# EAGLE design schema_mpb1_1 (EAGLE 9.0.1)

## Sheet 1 of 4: Power Conversion
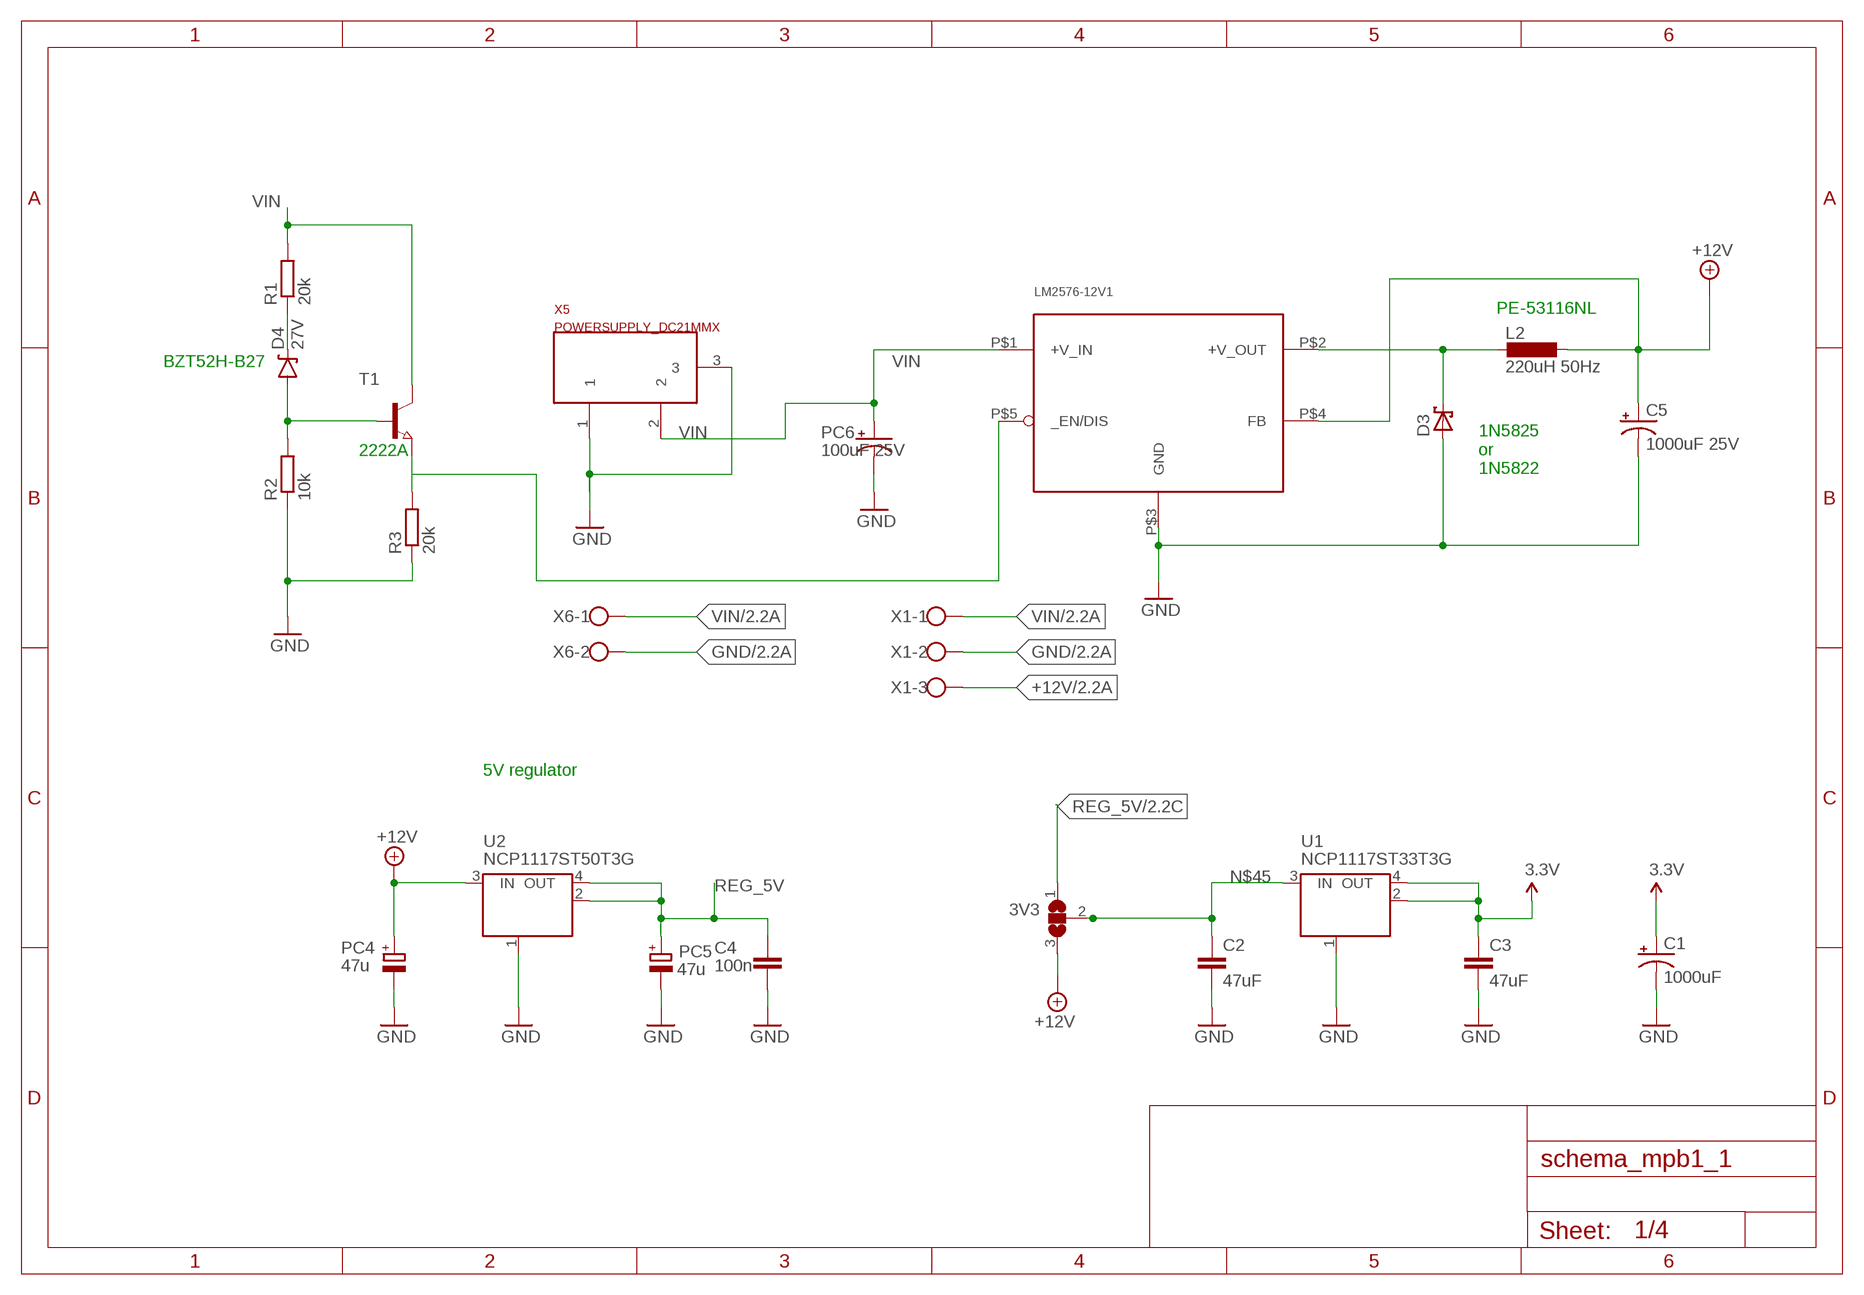
[diagram p0: schematic, sheet 1]

### Parts
3V3  SJ2W  [SJ_2]
C1  1000uF  CPOL-USE5-6  [E5-6]
C2  47uF  C-EUC0603  [C0603]
C3  47uF  C-EUC0603  [C0603]
C4  100n  C-EU0603-RND  [C0603-ROUND]
C5  1000uF 25V  CPOL-USE5-6  [E5-6]
D3  1N5908  [C4111-15]
D4  27V  DIODE-ZENER16V  [SOD-123]
L2  220uH 50Hz  L-KM4.0  [KM-4.0]
LM2576-12V1  LM2576-T05D  [TO220-5_STAGGERED]
PC4  47u  CPOL-EUD  [PANASONIC_D]
PC5  47u  CPOL-EUD  [PANASONIC_D]
PC6  100uF 25V  CPOL-USE5-6  [E5-6]
R1  20k  R-EU_R0603  [R0603]
R2  10k  R-EU_R0603  [R0603]
R3  20k  R-EU_R0603  [R0603]
T1  NPN-TRANSISTOR_SOT23  [SOT23]
U1  NCP1117ST33T3G  MC33269ST-3.3T3  [SOT223]
U2  NCP1117ST50T3G  MC33269ST-3.3T3  [SOT223]
X1  W237-103  [W237-103]
X5  POWERSUPPLY_DC21MMX  [POWERSUPPLY_DC-21MM]
X6  W237-102  [W237-102]

### Nets
3.3V [power]: C1.+ C3.1 U1.2(OUT) U1.4(OUT) ; also sheet 2
+12V: 3V3.3 C5.+ L2.P$2 LM2576-12V1.P$4(FB) PC4.+ U2.3(IN) X1.3 ; also sheet 2
GND [gnd]: C1.- C2.2 C3.2 C4.1 C5.- D3.A LM2576-12V1.P$3(GND) PC4.- PC5.- PC6.- R2.1 R3.1 U1.1(GND/ADJ) U2.1(GND/ADJ) X1.2 X5.1 X5.3 X6.2 ; also sheet 2
N$1: D3.C L2.P$1 LM2576-12V1.P$2(+V_OUT)
N$2: D4.A R2.2 T1.1(B)
N$3: D4.C R1.1
N$4 [gnd]: LM2576-12V1.P$5(_EN/DIS) R3.2 T1.2(E)
N$45: 3V3.2 C2.1 U1.3(IN)
REG_5V: 3V3.1 C4.2 PC5.+ U2.2(OUT) U2.4(OUT) ; also sheet 2
VIN [power]: LM2576-12V1.P$1(+V_IN) PC6.+ R1.2 T1.3(C) X1.1 X5.2 X6.1 ; also sheet 2

### Notes on the sheet
- PE-53116NL
- BZT52H-B27
- 2222A
- 1N5825
  or
  1N5822
- 5V regulator

## Sheet 2 of 4: General Board Outline
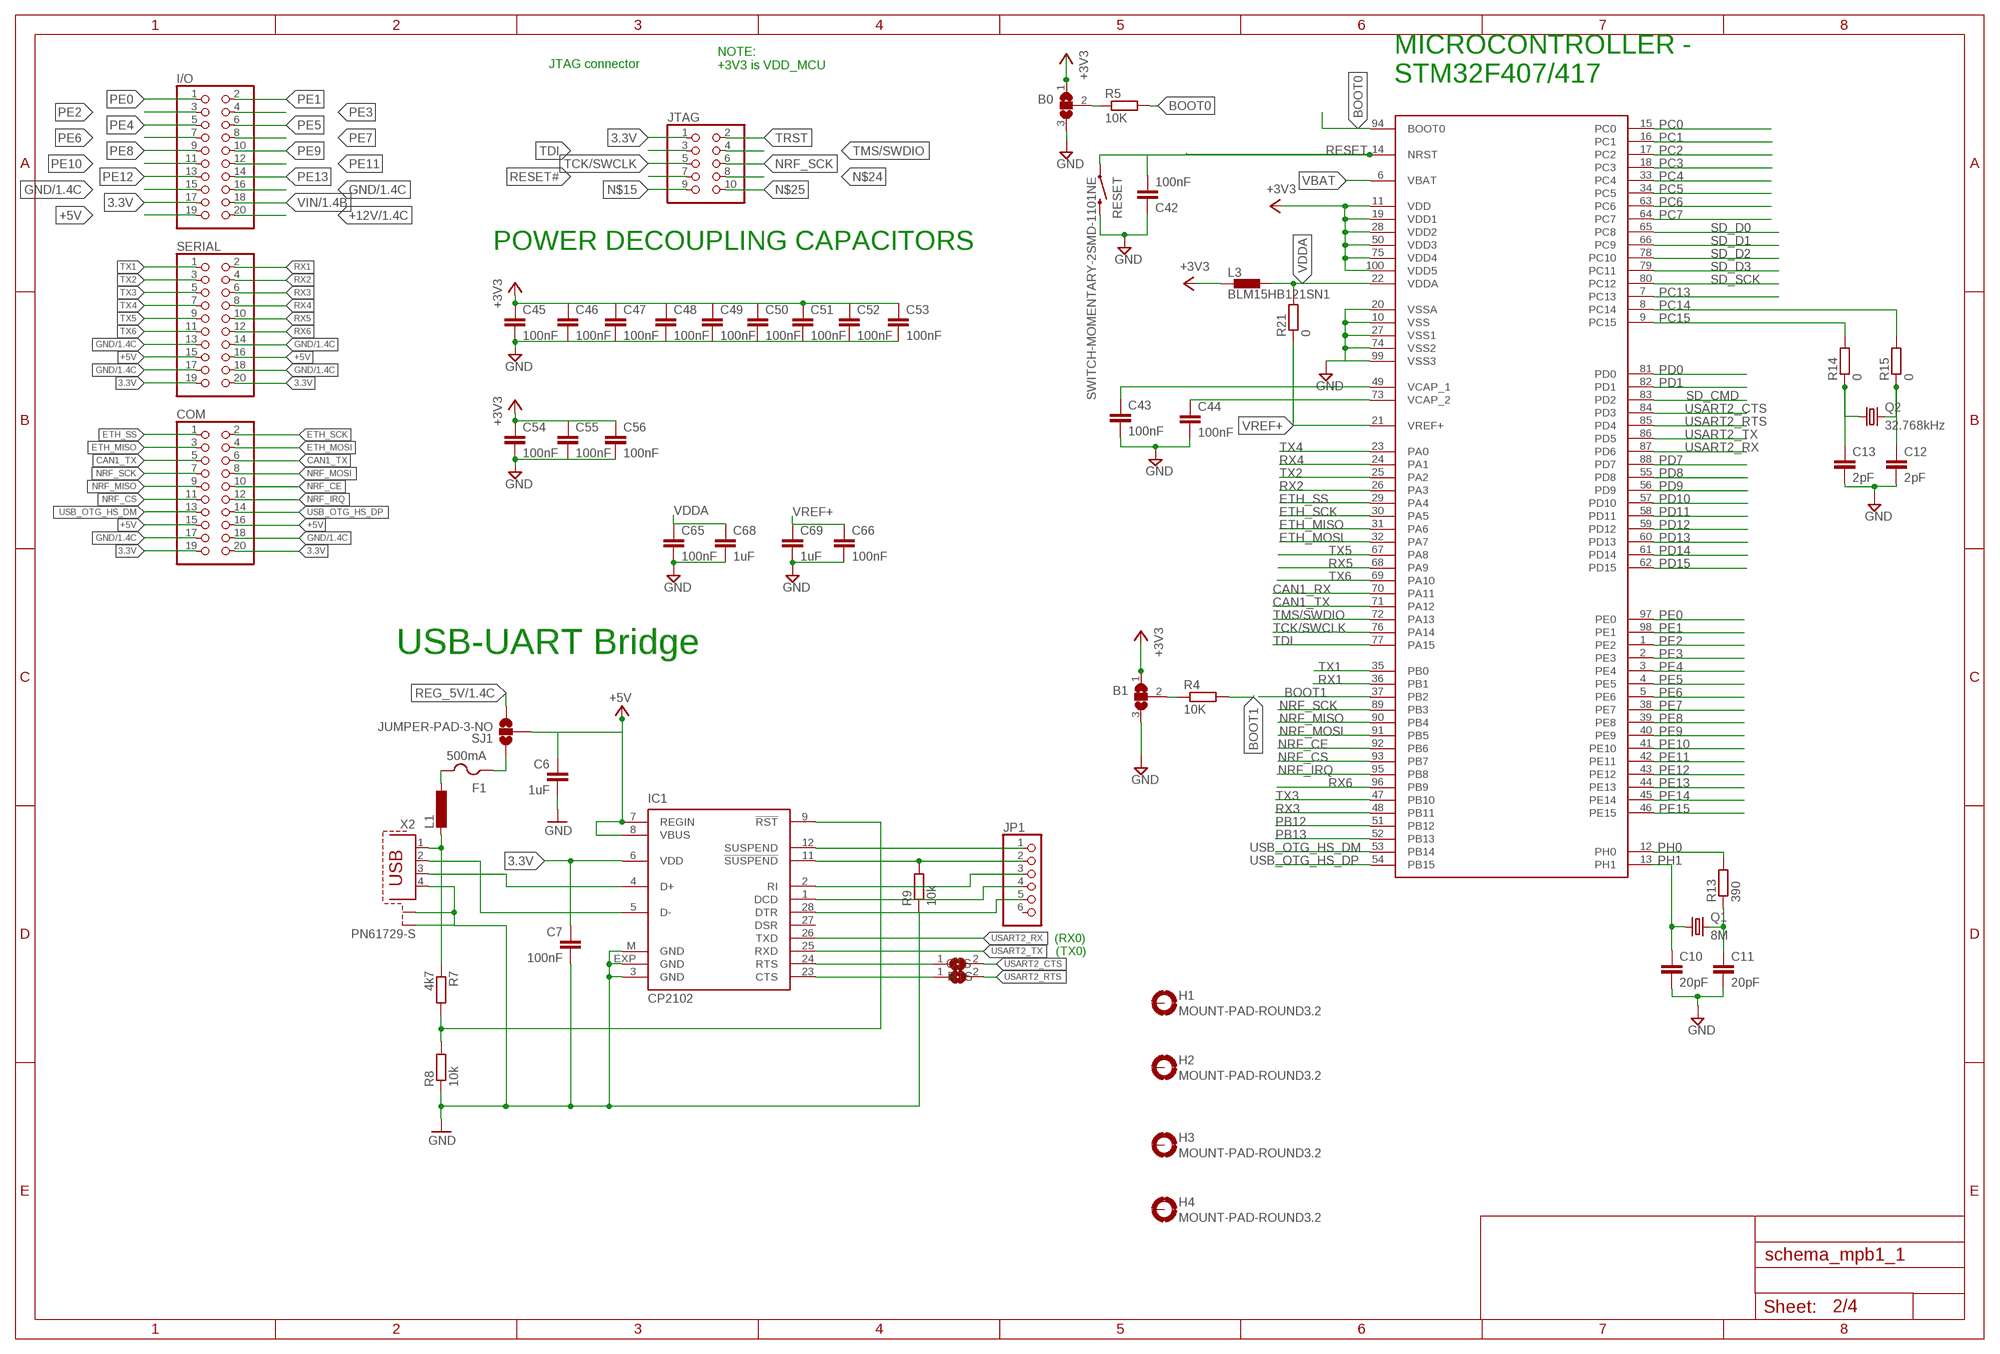
[diagram p1: schematic, sheet 2]

### Parts
B0  SJ2W  [SJ_2]
B1  SJ2W  [SJ_2]
C6  1uF  C-EU0603-RND  [C0603-ROUND]
C7  100nF  C-EU0603-RND  [C0603-ROUND]
C10  20pF  C-EUC0603  [C0603]
C11  20pF  C-EUC0603  [C0603]
C12  2pF  C-EUC0603  [C0603]
C13  2pF  C-EUC0603  [C0603]
C42  100nF  C-EUC0603  [C0603]
C43  100nF  C-EUC0603  [C0603]
C44  100nF  C-EUC0603  [C0603]
C45  100nF  C-EUC0603  [C0603]
C46  100nF  C-EUC0603  [C0603]
C47  100nF  C-EUC0603  [C0603]
C48  100nF  C-EUC0603  [C0603]
C49  100nF  C-EUC0603  [C0603]
C50  100nF  C-EUC0603  [C0603]
C51  100nF  C-EUC0603  [C0603]
C52  100nF  C-EUC0603  [C0603]
C53  100nF  C-EUC0603  [C0603]
C54  100nF  C-EUC0603  [C0603]
C55  100nF  C-EUC0603  [C0603]
C56  100nF  C-EUC0603  [C0603]
C65  100nF  C-EUC0603  [C0603]
C66  100nF  C-EUC0603  [C0603]
C68  1uF  C-EUC0603  [C0603]
C69  1uF  C-EUC0603  [C0603]
COM  PINHD-2X10_2.54  [2X10]
CTS  SJ  [SJ]
F1  500mA  PTCFUSE-1812  [1812]
H1  MOUNT-PAD-ROUND3.2  [3,2-PAD]
H2  MOUNT-PAD-ROUND3.2  [3,2-PAD]
H3  MOUNT-PAD-ROUND3.2  [3,2-PAD]
H4  MOUNT-PAD-ROUND3.2  [3,2-PAD]
I/O  PINHD-2X10_2.54  [2X10]
IC1  CP2102  [MLP28]
JP1  PINHD-1X6  [1X06]
JTAG  PINHD-2X05_2.00  [2X05M]
L1  L-EUL1812  [L1812]
L3  BLM15HB121SN1  [0402]
Q1  8M  CRYSTALHC49UP  [HC49UP]
Q2  32.768kHz  CRYSTALHC49UP  [HC49UP]
R4  10K  R-EU_R0603  [R0603]
R5  10K  R-EU_R0603  [R0603]
R7  4k7  R-EU_R0603  [R0603]
R8  10k  R-EU_R0603  [R0603]
R9  10k  R-EU_R0603  [R0603]
R13  390  R-EU_R0603  [R0603]
R14  0  R-EU_R0603  [R0603]
R15  0  R-EU_R0603  [R0603]
R21  0  R-EU_R0603  [R0603]
RESET  SWITCH-MOMENTARY-2SMD-1101NE  [TACTILE-SWITCH-1101NE]
RTS  SJ  [SJ]
SERIAL  PINHD-2X10_2.54  [2X10]
SJ1  JUMPER-PAD-3-NO  [PAD-JUMPER-3-NO_YES_SILK_FULL_BOX_WIDE_SPACING]
U$2  STM32F40XSTM32D40X  [LQFP100]
X2  PN61729-S  [PN61729-S]

### Nets
3.3V [power]: B0.1 B1.1 C7.1 C45.1 C46.1 C47.1 C48.1 C49.1 C50.1 C51.1 C52.1 C53.1 C54.1 C55.1 C56.1 COM.19 COM.20 I/O.17 IC1.6(VDD) JTAG.1 L3.1 SERIAL.19 SERIAL.20 U$2.11(VDD) U$2.19(VDD1) U$2.28(VDD2) U$2.50(VDD3) U$2.75(VDD4) U$2.100(VDD5) ; supply symbol labelled +3V3 ; also sheet 1
+5V [power usb]: C6.1 COM.15 COM.16 I/O.19 IC1.7(REGIN) IC1.8(VBUS) SERIAL.15 SERIAL.16 SJ1.2
+12V: I/O.20 ; also sheet 1
BOOT0: R5.2 U$2.94(BOOT0)
BOOT1: R4.2 U$2.37(PB2)
CAN1_RX: U$2.70(PA11)
CAN1_TX: COM.5 COM.6 U$2.71(PA12)
ETH_MISO: COM.3 U$2.31(PA6)
ETH_MOSI: COM.4 U$2.32(PA7)
ETH_SCK: COM.2 U$2.30(PA5)
ETH_SS: COM.1 U$2.29(PA4)
GND [gnd]: B0.3 B1.3 C6.2 C7.2 C10.2 C11.2 C12.2 C13.2 C42.1 C43.2 C44.2 C45.2 C46.2 C47.2 C48.2 C49.2 C50.2 C51.2 C52.2 C53.2 C54.2 C55.2 C56.2 C65.2 C66.2 C68.2 C69.2 COM.17 COM.18 I/O.15 I/O.16 IC1.3(GND) IC1.EXP(GND) IC1.M(GND) R8.1 R9.1 RESET.2 SERIAL.13 SERIAL.14 SERIAL.17 SERIAL.18 U$2.10(VSS) U$2.20(VSSA) U$2.27(VSS1) U$2.74(VSS2) U$2.99(VSS3) X2.4 X2.S1 X2.S2 ; also sheet 1
N$5: B1.2 R4.1
N$6: B0.2 R5.1
N$8: IC1.9(!RST) R7.2 R8.2
N$9: C11.1 Q1.2 R13.1
N$10: C12.1 Q2.2 R15.1
N$11: IC1.2(RI) JP1.3
N$12: C13.1 Q2.1 R14.1
N$13: IC1.5(D-) X2.2
N$14: IC1.4(D+) X2.3
N$15: JTAG.9
N$16: C44.1 U$2.73(VCAP_2)
N$17: L1.2 R7.1 X2.1
N$18: F1.2 L1.1
N$19: IC1.1(DCD) JP1.4
N$20: C43.1 U$2.49(VCAP_1)
N$21: IC1.11(!SUSPEND) JP1.2 R9.2
N$24: JTAG.8
N$25: JTAG.10
N$26: IC1.12(SUSPEND) JP1.1
N$27: IC1.28(DTR) JP1.5
N$41: CTS.1 IC1.24(RTS)
N$44: IC1.23(CTS) RTS.1
NRF_CE: COM.10 U$2.92(PB6)
NRF_CS: COM.11 U$2.93(PB7)
NRF_IRQ: COM.12 U$2.95(PB8)
NRF_MISO: COM.9 U$2.90(PB4)
NRF_MOSI: COM.8 U$2.91(PB5)
NRF_SCK: COM.7 JTAG.6 U$2.89(PB3)
PB12: U$2.51(PB12)
PB13: U$2.52(PB13)
PC0: U$2.15(PC0)
PC1: U$2.16(PC1)
PC2: U$2.17(PC2)
PC3: U$2.18(PC3)
PC4: U$2.33(PC4)
PC5: U$2.34(PC5)
PC6: U$2.63(PC6)
PC7: U$2.64(PC7)
PC13: U$2.7(PC13)
PC14: R15.2 U$2.8(PC14)
PC15: R14.2 U$2.9(PC15)
PD0: U$2.81(PD0)
PD1: U$2.82(PD1)
PD7: U$2.88(PD7)
PD8: U$2.55(PD8)
PD9: U$2.56(PD9)
PD10: U$2.57(PD10)
PD11: U$2.58(PD11)
PD12: U$2.59(PD12)
PD13: U$2.60(PD13)
PD14: U$2.61(PD14)
PD15: U$2.62(PD15)
PE0: I/O.1 U$2.97(PE0)
PE1: I/O.2 U$2.98(PE1)
PE2: I/O.3 U$2.1(PE2)
PE3: I/O.4 U$2.2(PE3)
PE4: I/O.5 U$2.3(PE4)
PE5: I/O.6 U$2.4(PE5)
PE6: I/O.7 U$2.5(PE6)
PE7: I/O.8 U$2.38(PE7)
PE8: I/O.9 U$2.39(PE8)
PE9: I/O.10 U$2.40(PE9)
PE10: I/O.11 U$2.41(PE10)
PE11: I/O.12 U$2.42(PE11)
PE12: I/O.13 U$2.43(PE12)
PE13: I/O.14 U$2.44(PE13)
PE14: U$2.45(PE14)
PE15: U$2.46(PE15)
PH0: R13.2 U$2.12(PH0)
PH1: C10.1 Q1.1 U$2.13(PH1)
REG_5V: SJ1.3 ; also sheet 1
RESET: C42.2 RESET.1 U$2.14(NRST)
RESET#: JTAG.7
RX1: SERIAL.2 U$2.36(PB1)
RX2: SERIAL.4 U$2.26(PA3)
RX3: SERIAL.6 U$2.48(PB11)
RX4: SERIAL.8 U$2.24(PA1)
RX5: SERIAL.10 U$2.68(PA9)
RX6: SERIAL.12 U$2.96(PB9)
SD_CMD: U$2.83(PD2)
SD_D0: U$2.65(PC8)
SD_D1: U$2.66(PC9)
SD_D2: U$2.78(PC10)
SD_D3: U$2.79(PC11)
SD_SCK: U$2.80(PC12)
TCK/SWCLK: JTAG.5 U$2.76(PA14)
TDI: JTAG.3 U$2.77(PA15)
TMS/SWDIO: JTAG.4 U$2.72(PA13)
TRST: JTAG.2
TX1: SERIAL.1 U$2.35(PB0)
TX2: SERIAL.3 U$2.25(PA2)
TX3: SERIAL.5 U$2.47(PB10)
TX4: SERIAL.7 U$2.23(PA0)
TX5: SERIAL.9 U$2.67(PA8)
TX6: SERIAL.11 U$2.69(PA10)
USART2_CTS: CTS.2 U$2.84(PD3)
USART2_RTS: RTS.2 U$2.85(PD4)
USART2_RX: IC1.26(TXD) U$2.87(PD6)
USART2_TX: IC1.25(RXD) U$2.86(PD5)
USB_OTG_HS_DM: COM.13 U$2.53(PB14)
USB_OTG_HS_DP: COM.14 U$2.54(PB15)
VBAT: U$2.6(VBAT)
VDDA: C65.1 C68.1 L3.2 R21.2 U$2.22(VDDA)
VIN [power]: I/O.18 ; also sheet 1
VREF+: C66.1 C69.1 R21.1 U$2.21(VREF+)
VUSB2: F1.1 SJ1.1
Unconnected: H1.B3,2(MOUNT) H2.B3,2(MOUNT) H3.B3,2(MOUNT) H4.B3,2(MOUNT) IC1.27(DSR) JP1.6

### Notes on the sheet
- JTAG connector
- NOTE:
  +3V3 is VDD_MCU
- MICROCONTROLLER - 
  STM32F407/417
- POWER DECOUPLING CAPACITORS
- USB-UART Bridge
- (RX0)
- (TX0)

## Sheet 3 of 4: Logo
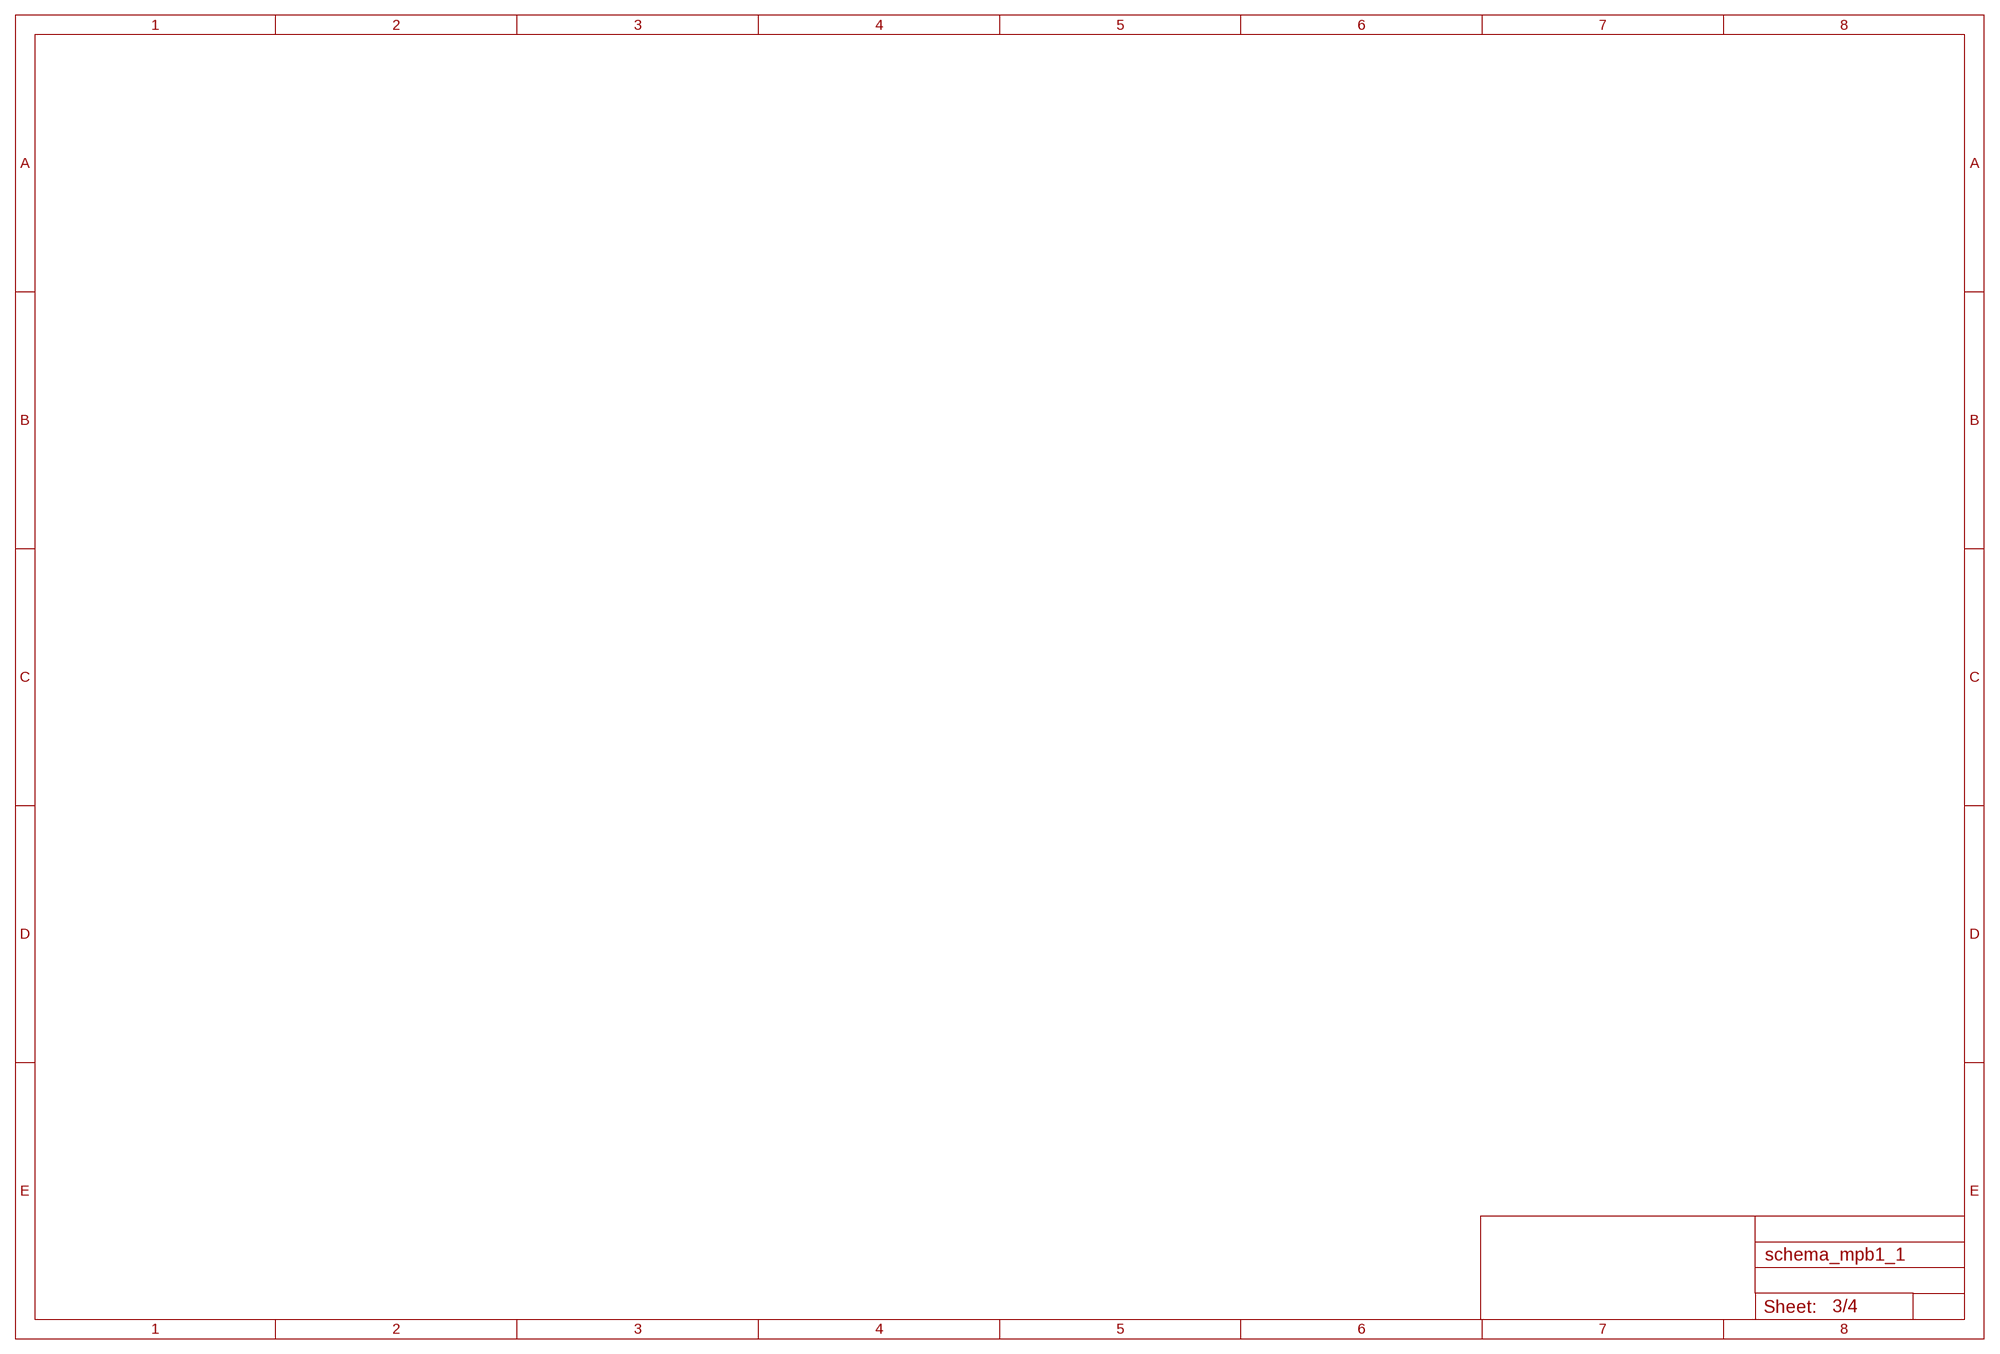
[diagram p2: schematic, sheet 3]

## Sheet 4 of 4

## Library data of the parts
3V3 B0 B1 = jumper:SJ2W: SMD solder JUMPER
C1 C5 PC6 = adafruit:CPOL-US: POLARIZED CAPACITOR, American symbol
C2 C3 = rcl:C-EU: CAPACITOR, European symbol
C4 C6 C7 = SmartPrj:C-EU: CAPACITOR, European symbol
C10-C13 C42-C56 C65 C66 C68 C69 = resistor:C-EU: CAPACITOR, European symbol
COM I/O SERIAL = pinhead-2:PINHD-2X10: PIN HEADER
CTS RTS = jumper:SJ: SMD solder JUMPER
D3 = diode:1N5908: DIODE schottky
D4 = SparkFun-DiscreteSemi:DIODE-ZENER: Zener Diode Production Part - 8199 3.4V Zener Voltage; PROD_ID: DIO-12440; VALUE: 16V
F1 = adafruit:PTCFUSE: PTC fuses, resettable thermistors
H1-H4 = holes:MOUNT-PAD-ROUND: MOUNTING PAD, round
IC1 = silabs-2:CP210*: Single-Chip USB to UART Bridge Source: www.silabs.com .. CP2101.pdf / cp2102.pdf
JP1 = pinhead:PINHD-1X6: PIN HEADER
JTAG = pinhead-2:PINHD-2X05: PIN HEADER
L1 = rcl:L-EU: INDUCTOR, European symbol
L2 = inductor_Noyle:L-KM4.0
L3 = inductors:BLM15H: EMIFIL (R) Chip Ferrite Bead for GHz Noise Source: http://www.murata.com/ Ferrite Bead BLM15H.pdf
LM2576-12V1 = LM2576:LM2576-T05D: LM2576/LM2576HV Series SIMPLE SWITCHER® 3A Step-Down Voltage Regulator STAGGERED PACKAGE
PC4 PC5 = rcl:CPOL-EU: POLARIZED CAPACITOR, European symbol
Q1 Q2 = crystal:CRYSTAL: CRYSTAL; OC_FARNELL: unknown; OC_NEWARK: unknown
R1-R3 = rcl:R-EU_: RESISTOR, European symbol
R4 R5 = rcl:R-EU_: RESISTOR, European symbol; SPICEPREFIX: R
R7-R9 R13-R15 R21 = resistor:R-EU_: RESISTOR, European symbol
RESET = SparkFun-Electromechanical:SWITCH-MOMENTARY-2: Various NO switches- pushbuttons, reed, etc; PROD_ID: SWCH-00815
SJ1 = SparkFun-Passives:JUMPER-PAD-3-NO
T1 = semicon-smd-ipc:NPN-TRANSISTOR_: NPN TRANSISTOR
U1 U2 = linear:MC33269ST*: Adjustable Output Low Dropout Voltage Regulator 800 mA Source: http://www.onsemi.com/pub/Collateral/MC33269-D.PDF
U$2 = stm32f:STM32F40X: Features • Core: ARM 32-bit Cortex™-M4 CPU with FPU, Adaptive real-time accelerator (ART Accelerator™) allowing 0-wait state execution from Flash memory, frequency up to 168 MHz, memory protection unit, 210 DMIPS/ 1.25 DMIPS/MHz (Dhrystone 2.1), and DSP instructions • Memories – Up to 1 Mbyte of Flash memory – Up to 192+4 Kbytes of SRAM including 64- Kbyte of CCM (core coupled memory) data RAM – Flexible static memory controller supporting Compact Flash, SRAM, PSRAM, NOR and NAND memories • LCD parallel interface, 8080/6800 modes • Clock, reset and supply management – 1.8 V to 3.6 V application supply and I/Os – POR, PDR, PVD and BOR – 4-to-26 MHz crystal oscillator – Internal 16 MHz factory-trimmed RC (1% accuracy) – 32 kHz oscillator for RTC with calibration – Internal 32 kHz RC with calibration • Low power – Sleep, Stop and Standby modes – VBAT supply for RTC, 20×32 bit backup registers + optional 4 KB backup SRAM • 3×12-bit, 2.4 MSPS A/D converters: up to 24 channels and 7.2 MSPS in triple interleaved mode • 2×12-bit D/A converters • General-purpose DMA: 16-stream DMA controller with FIFOs and burst support • Up to 17 timers: up to twelve 16-bit and two 32- bit timers up to 168 MHz, each with up to 4 IC/OC/PWM or pulse counter and quadrature (incremental) encoder input • Debug mode – Serial wire debug (SWD) & JTAG interfaces – Cortex-M4 Embedded Trace Macrocell™ • Up to 140 I/O ports with interrupt capability – Up to 136 fast I/Os up to 84 MHz – Up to 138 5 V-tolerant I/Os • Up to 15 communication interfaces – Up to 3 × I2C interfaces (SMBus/PMBus) – Up to 4 USARTs/2 UARTs (10.5 Mbit/s, ISO 7816 interface, LIN, IrDA, modem control) – Up to 3 SPIs (42 Mbits/s), 2 with muxed full-duplex I2S to achieve audio class accuracy via internal audio PLL or external clock – 2 × CAN interfaces (2.0B Active) – SDIO interface • Advanced connectivity – USB 2.0 full-speed device/host/OTG controller with on-chip PHY – USB 2.0 high-speed/full-speed device/host/OTG controller with dedicated DMA, on-chip full-speed PHY and ULPI – 10/100 Ethernet MAC with dedicated DMA: supports IEEE 1588v2 hardware, MII/RMII • 8- to 14-bit parallel camera interface up to 54 Mbytes/s • True random number generator • CRC calculation unit • 96-bit unique ID • RTC: subsecond accuracy, hardware calendar
X1 = con-wago-500:W237-103: WAGO SCREW CLAMP; MPN: 237-103; OC_FARNELL: unknown; OC_NEWARK: 18M7116
X2 = con-berg:PN61729-S: BERG USB connector; OC_FARNELL: unknown; OC_NEWARK: unknown
X5 = SmartPrj:POWERSUPPLY_DC21MM
X6 = con-wago-500:W237-102: WAGO SCREW CLAMP; MPN: 237-102; OC_FARNELL: unknown; OC_NEWARK: 70K9898

## Net classes
1 power: width 0.152 mm, drill 0.152 mm, clearance 0.152 mm
2 gnd: width 0.152 mm, drill 0.152 mm, clearance 0.152 mm
3 power usb: width 0.152 mm, drill 0.152 mm, clearance 0.152 mm

## Board
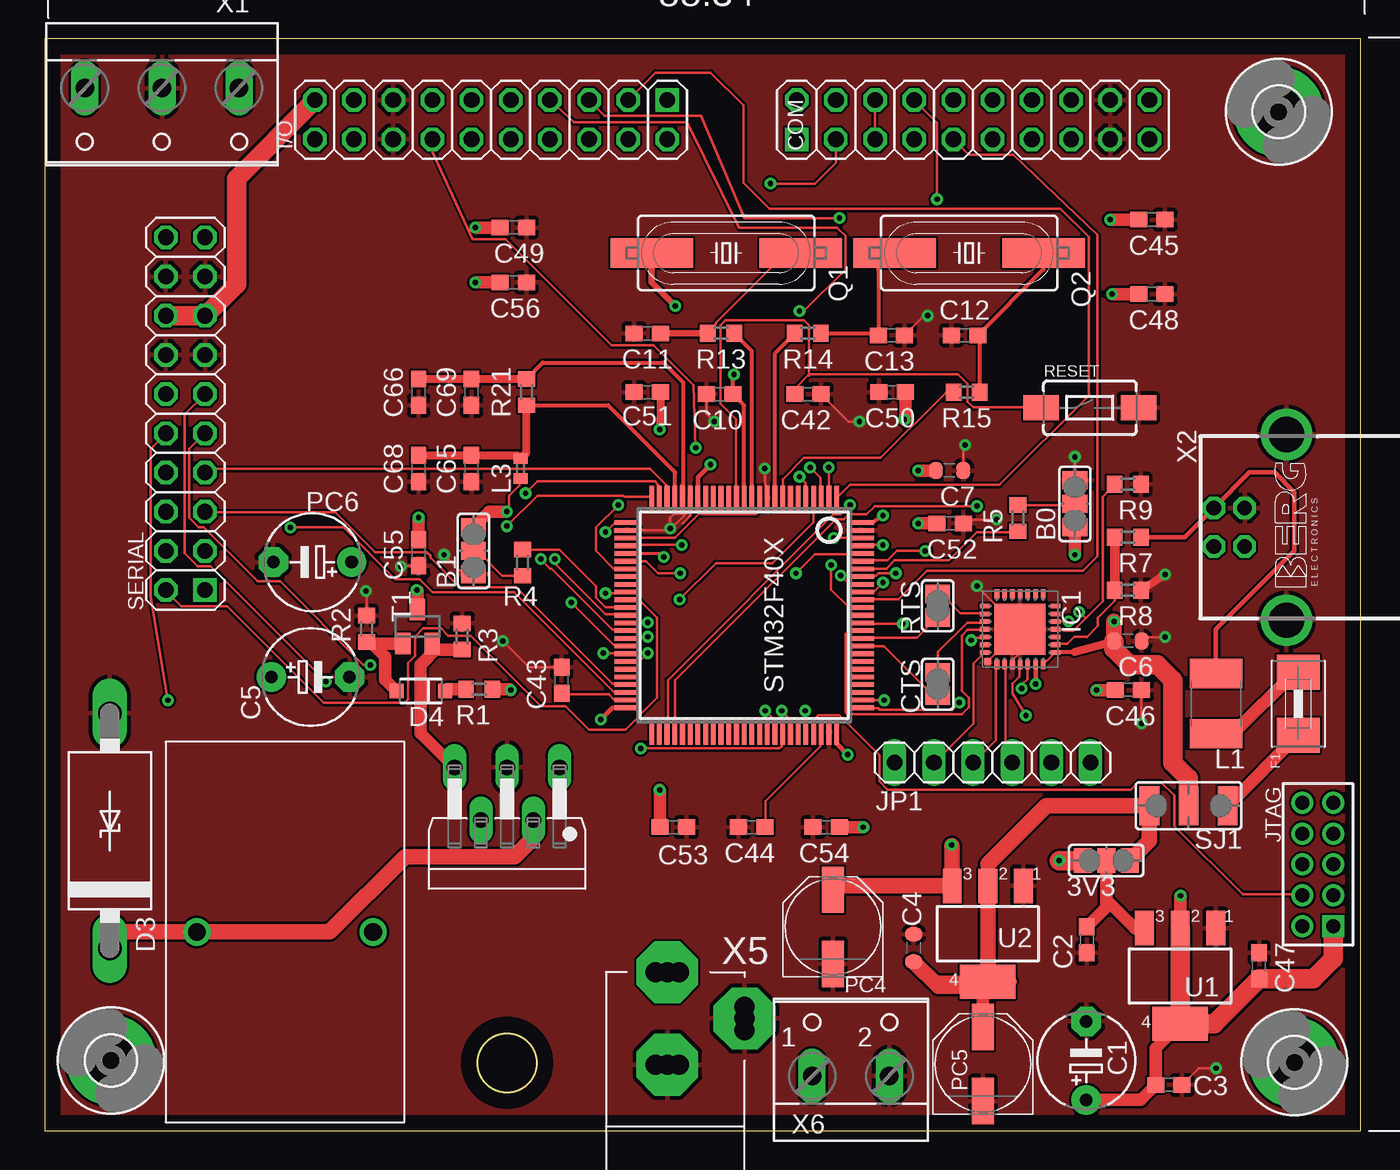
[diagram p3: board, top side]
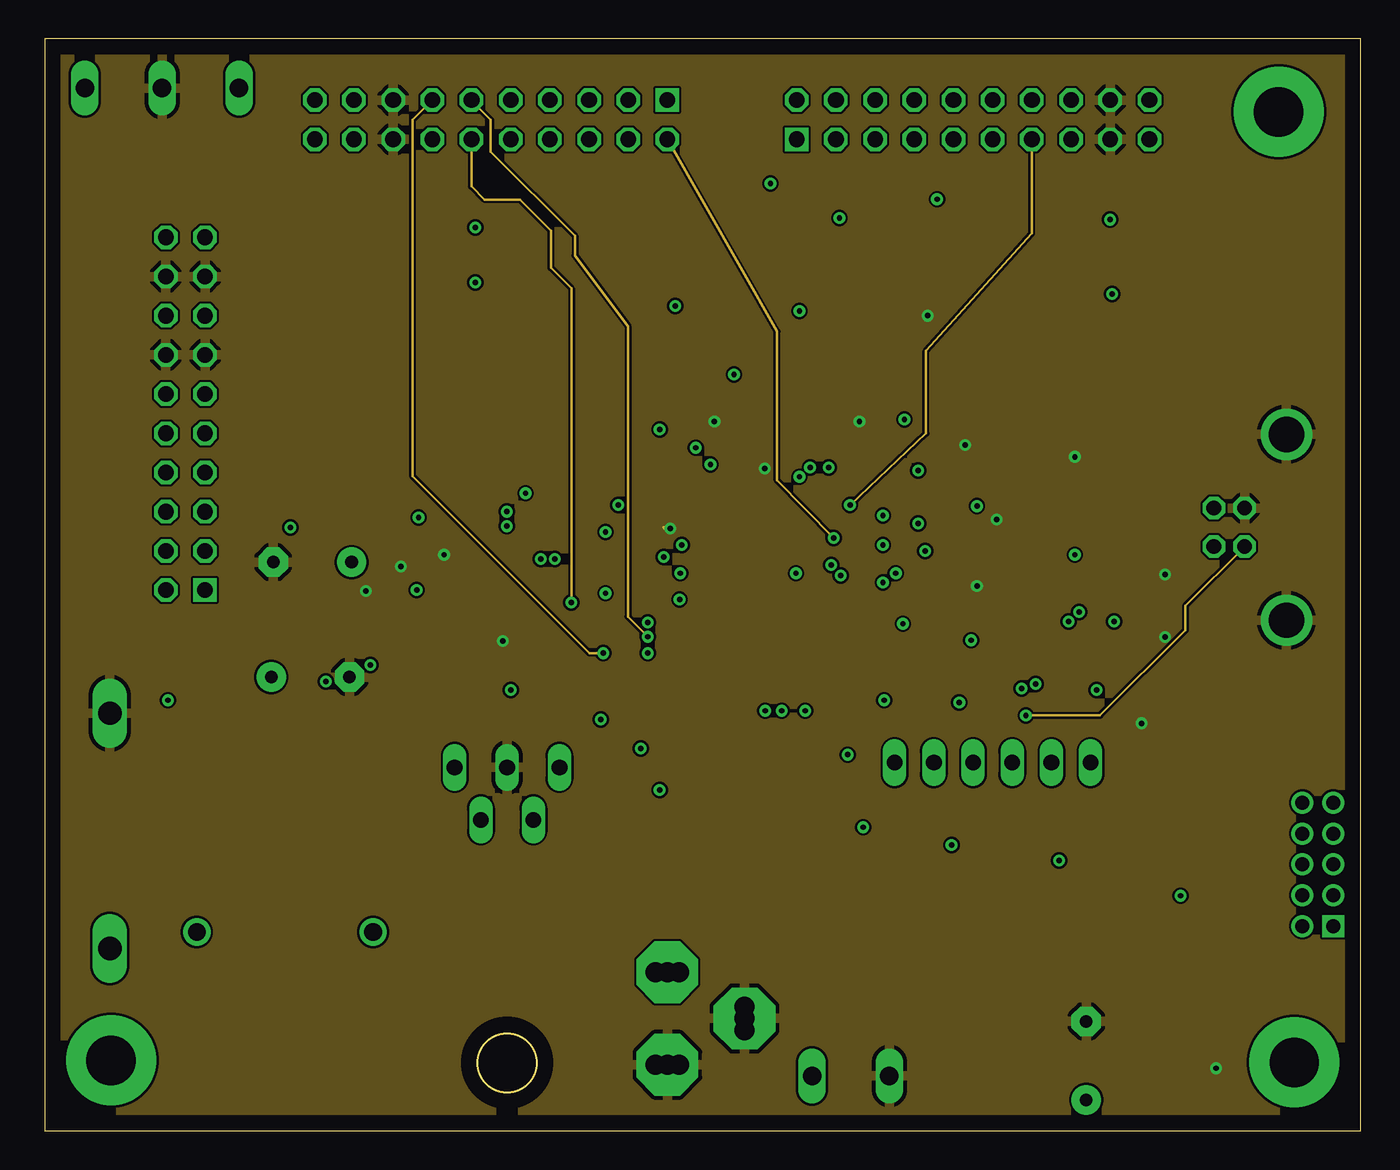
[diagram p4: board, inner layer GND]
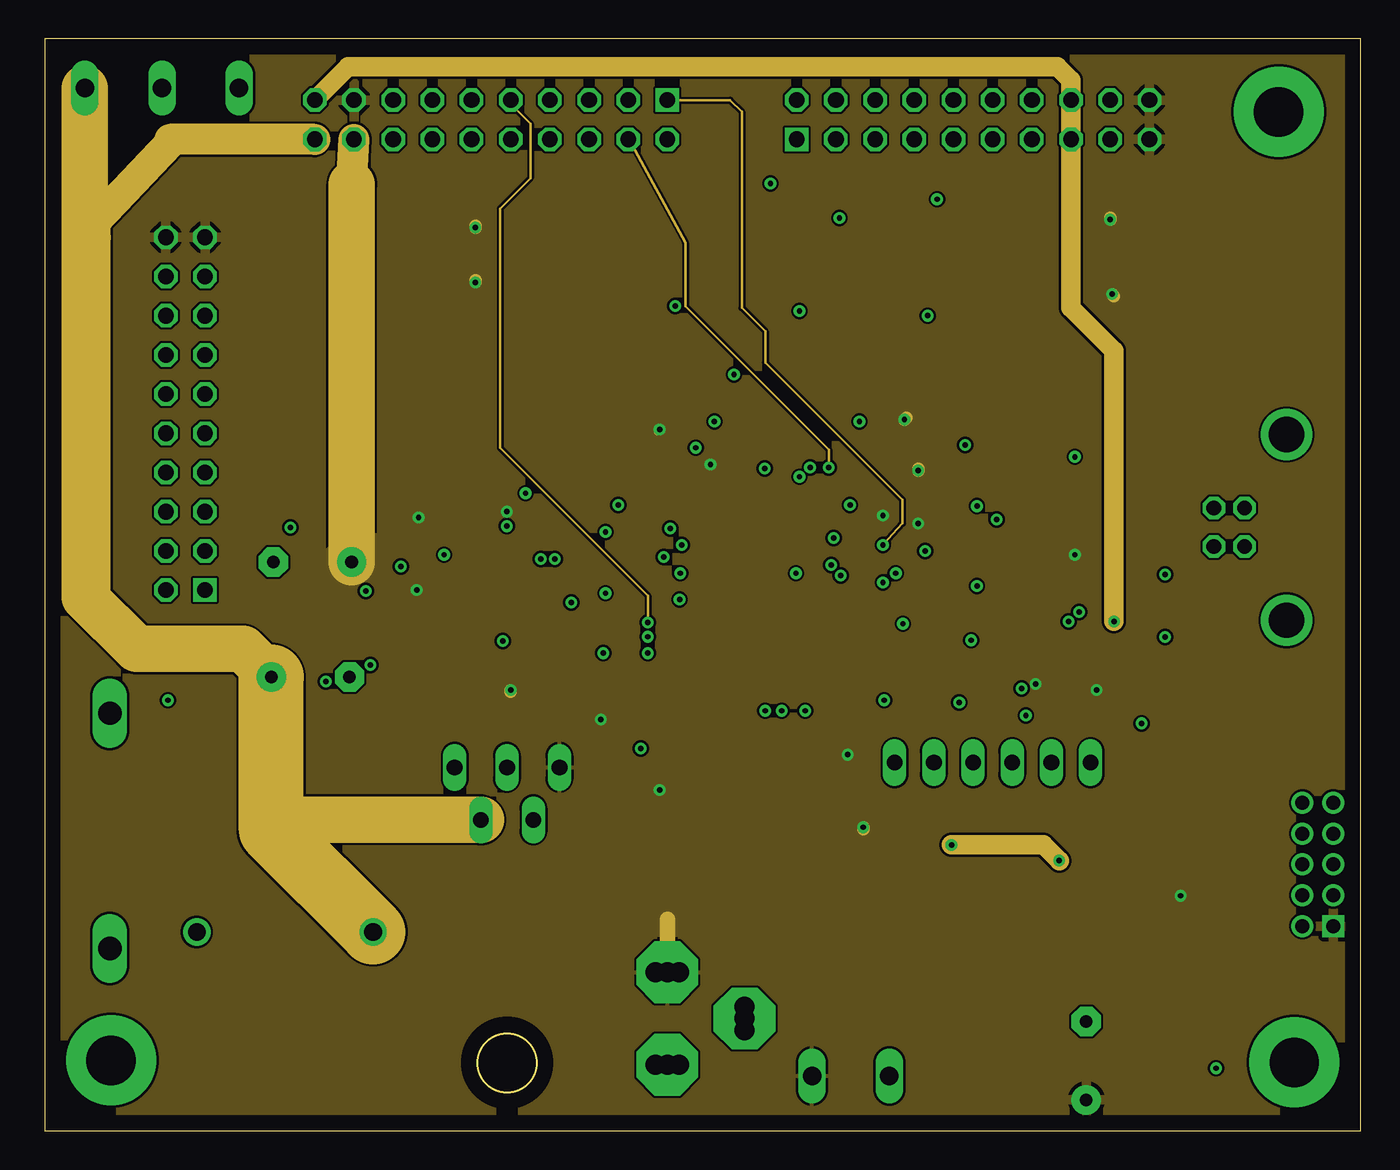
[diagram p5: board, inner layer 3.3V]
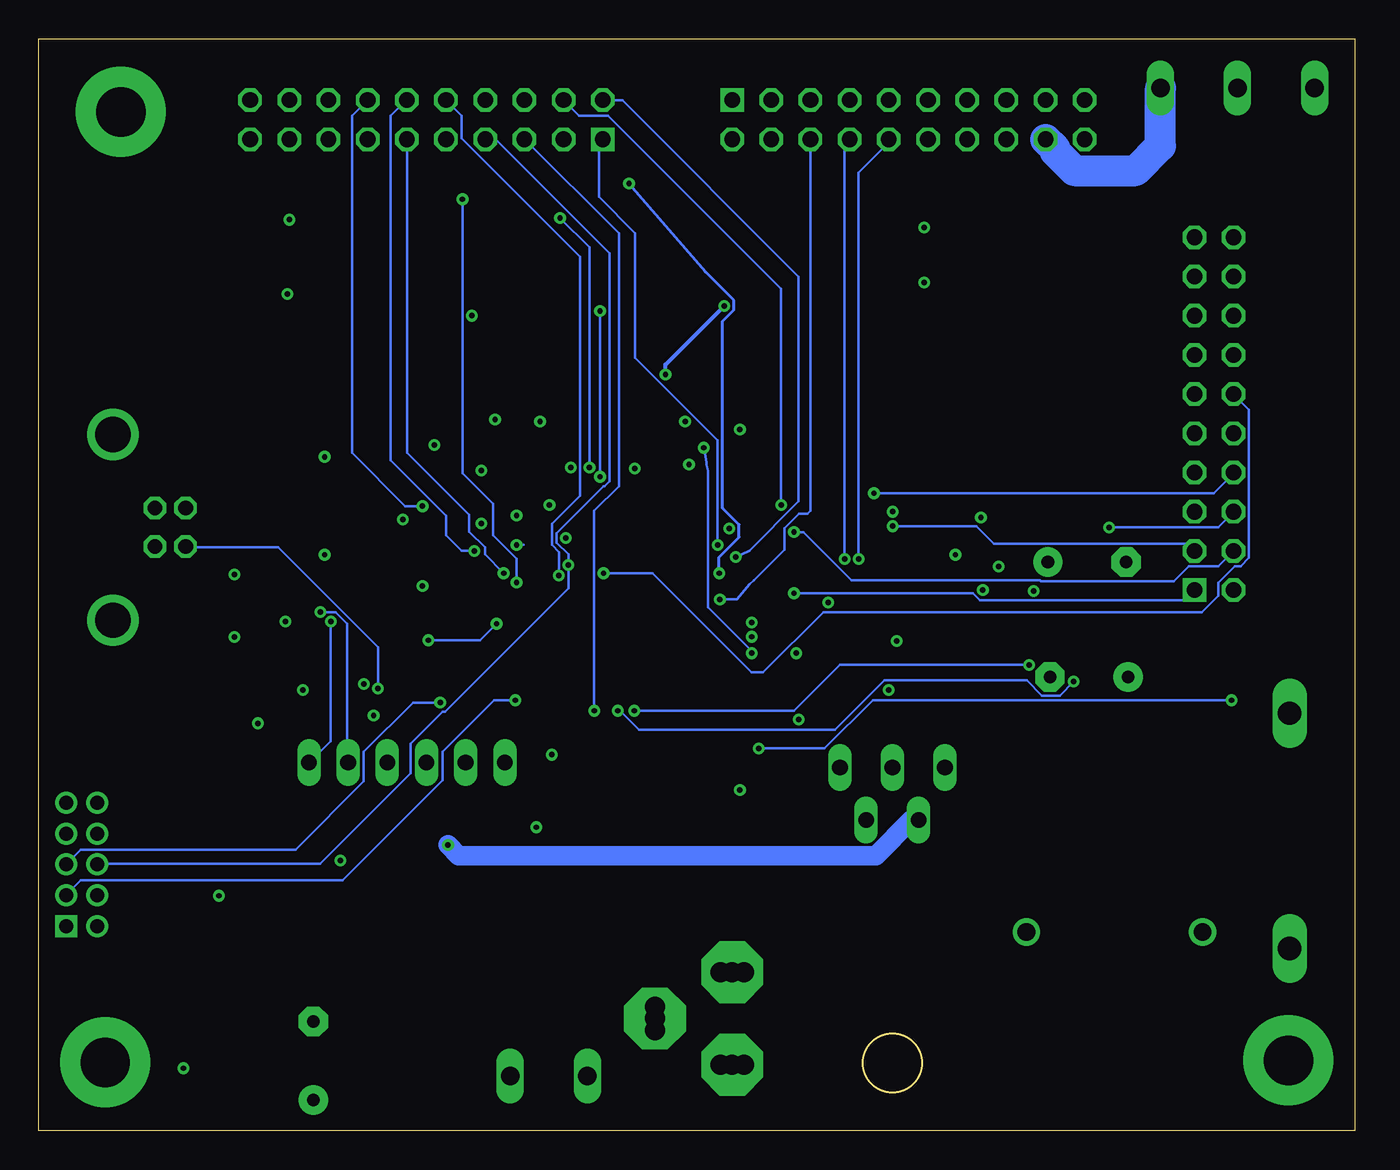
[diagram p6: board, bottom side, seen from below]

Size 85.33 x 70.79 mm. Coordinates in mm from the lower left corner, seen from the top.
Outline: 85.33,0 85.33,70.79 0,70.79 0,0 85.33,0
Copper layers (1+2*15+16): Top 0.035mm / dielectric 0.18mm / GND 0.017mm / dielectric 1.12mm / 3.3V 0.017mm / dielectric 0.18mm / Bottom 0.035mm
Design rules "default *": minimum track width 6mil, minimum drill 0.35mm, track to track 6mil, track to pad 6mil, pad to pad 6mil, via to via 6mil, smd to smd 6mil, copper to edge 40mil, drill to drill 6mil, minimum pad ring 10mil, minimum via ring 8mil, stop-mask expansion 4mil, vias tented up to drill 0mil, thermal gap 10mil

### Footprints (pad centres in the part's own frame; a part is rotated, then mirrored left to right if it is on the bottom)
SJ_2 = smd 1.168 x 1.6: 1 -1.524,0; 2 0,0; 3 1.524,0
E5-6 = drill 0.813 pad 1.905: + -2.54,0 | drill 0.813 pad 1.905 octagon: - 2.54,0
C0603 = smd 1.1 x 1: 1 -0.85,0; 2 0.85,0
C0603-ROUND = smd 0.898 x 1.1: 1 -0.889,0; 2 0.889,0
2X10 = drill 1.016 square: 1 -11.43,-1.27 | drill 1.016 octagon: 2 -11.43,1.27; 3 -8.89,-1.27; 4 -8.89,1.27; 5 -6.35,-1.27; 6 -6.35,1.27; 7 -3.81,-1.27; 8 -3.81,1.27; 9 -1.27,-1.27; 10 -1.27,1.27; 11 1.27,-1.27; 12 1.27,1.27; 13 3.81,-1.27; 14 3.81,1.27; 15 6.35,-1.27; 16 6.35,1.27; 17 8.89,-1.27; 18 8.89,1.27; 19 11.43,-1.27; 20 11.43,1.27
SJ = smd 1.168 x 1.6: 1 -0.762,0; 2 0.762,0
C4111-15 = drill 1.499 long: A 7.62,0; C -7.62,0
SOD-123 = smd 0.9 x 0.95: A 1.575,0; C -1.575,0
1812 = smd 2.286 x 2.794: 1 -2.046,0; 2 2.046,0
3,2-PAD = drill 3.2 pad 5.842: B3,2 0,0
MLP28 = smd 0.6 x 0.3: 1 -2.3,1.5; 2 -2.3,1; 3 -2.3,0.5; 4 -2.3,0; 5 -2.3,-0.5; 6 -2.3,-1; 7 -2.3,-1.5; 15 2.3,-1.5; 16 2.3,-1; 17 2.3,-0.5; 18 2.3,0; 19 2.3,0.5; 20 2.3,1; 21 2.3,1.5 | smd 0.3 x 0.6: 8 -1.5,-2.3; 9 -1,-2.3; 10 -0.5,-2.3; 11 0,-2.3; 12 0.5,-2.3; 13 1,-2.3; 14 1.5,-2.3; 22 1.5,2.3; 23 1,2.3; 24 0.5,2.3; 25 0,2.3; 26 -0.5,2.3; 27 -1,2.3; 28 -1.5,2.3 | smd 3.3 x 3.3: EXP 0,0 | smd 0.435 x 0.435: M -2.103,2.103
1X06 = drill 1.016 long: 1 -6.35,0; 2 -3.81,0; 3 -1.27,0; 4 1.27,0; 5 3.81,0; 6 6.35,0
2X05M = drill 0.914 square: 1 -4,-1 | drill 0.914: 2 -4,1; 3 -2,-1; 4 -2,1; 5 0,-1; 6 0,1; 7 2,-1; 8 2,1; 9 4,-1; 10 4,1
L1812 = smd 1.9 x 3.4: 1 -1.95,0; 2 1.95,0
KM-4.0 = drill 1.143 pad 1.778: P$1 -5.715,0; P$2 5.715,0
0402 = smd 0.7 x 0.9: 1 -0.65,0; 2 0.65,0
TO220-5_STAGGERED = drill 1.016 long: P$1 -3.396,-3.404; P$2 -1.7,-0.002; P$3 0.004,-3.4; P$4 1.7,0.002; P$5 3.404,-3.396
PANASONIC_D = smd 3 x 1.4: + 2.4,0; - -2.4,0
HC49UP = smd 5.334 x 1.93: 1 -4.826,0; 2 4.826,0
R0603 = smd 1 x 1.1: 1 -0.85,0; 2 0.85,0
TACTILE-SWITCH-1101NE = smd 2.3 x 1.6: 1 -3.15,0; 2 3.15,0
PAD-JUMPER-3-NO_YES_SILK_FULL_BOX_WIDE_SPACING = smd 1.27 x 2.54: 1 -2.54,0; 2 0,0; 3 2.54,0
SOT23 = smd 1 x 1.4: 1 -0.95,-1.1; 2 0.95,-1.1; 3 0,1.1
SOT223 = smd 1.219 x 2.235: 1 -2.311,-3.099; 2 0,-3.099; 3 2.311,-3.099 | smd 3.6 x 2.2: 4 0,3.099
LQFP100 = smd 1.6 x 0.3: 1 -7.6,6; 2 -7.6,5.5; 3 -7.6,5; 4 -7.6,4.5; 5 -7.6,4; 6 -7.6,3.5; 7 -7.6,3; 8 -7.6,2.5; 9 -7.6,2; 10 -7.6,1.5; 11 -7.6,1; 12 -7.6,0.5; 13 -7.6,0; 14 -7.6,-0.5; 15 -7.6,-1; 16 -7.6,-1.5; 17 -7.6,-2; 18 -7.6,-2.5; 19 -7.6,-3; 20 -7.6,-3.5; 21 -7.6,-4; 22 -7.6,-4.5; 23 -7.6,-5; 24 -7.6,-5.5; 25 -7.6,-6; 51 7.6,-6; 52 7.6,-5.5; 53 7.6,-5; 54 7.6,-4.5; 55 7.6,-4; 56 7.6,-3.5; 57 7.6,-3; 58 7.6,-2.5; 59 7.6,-2; 60 7.6,-1.5; 61 7.6,-1; 62 7.6,-0.5; 63 7.6,0; 64 7.6,0.5; 65 7.6,1; 66 7.6,1.5; 67 7.6,2; 68 7.6,2.5; 69 7.6,3; 70 7.6,3.5; 71 7.6,4; 72 7.6,4.5; 73 7.6,5; 74 7.6,5.5; 75 7.6,6 | smd 0.3 x 1.6: 26 -6,-7.6; 27 -5.5,-7.6; 28 -5,-7.6; 29 -4.5,-7.6; 30 -4,-7.6; 31 -3.5,-7.6; 32 -3,-7.6; 33 -2.5,-7.6; 34 -2,-7.6; 35 -1.5,-7.6; 36 -1,-7.6; 37 -0.5,-7.6; 38 0,-7.6; 39 0.5,-7.6; 40 1,-7.6; 41 1.5,-7.6; 42 2,-7.6; 43 2.5,-7.6; 44 3,-7.6; 45 3.5,-7.6; 46 4,-7.6; 47 4.5,-7.6; 48 5,-7.6; 49 5.5,-7.6; 50 6,-7.6; 76 6,7.6; 77 5.5,7.6; 78 5,7.6; 79 4.5,7.6; 80 4,7.6; 81 3.5,7.6; 82 3,7.6; 83 2.5,7.6; 84 2,7.6; 85 1.5,7.6; 86 1,7.6; 87 0.5,7.6; 88 0,7.6; 89 -0.5,7.6; 90 -1,7.6; 91 -1.5,7.6; 92 -2,7.6; 93 -2.5,7.6; 94 -3,7.6; 95 -3.5,7.6; 96 -4,7.6; 97 -4.5,7.6; 98 -5,7.6; 99 -5.5,7.6; 100 -6,7.6
W237-103 = drill 1.194 long: 1 -5,-1.29; 2 0,-1.29; 3 5,-1.29
PN61729-S = drill 0.95 octagon: 1 1.25,4.71; 2 -1.25,4.71; 3 -1.25,2.71; 4 1.25,2.71 | drill 2.3 pad 2.9: S1 -6.02,0; S2 6.02,0
POWERSUPPLY_DC-21MM = drill 1.3 pad 4 octagon: 1 -5.08,-3.353; 2 -0.076,-6.35; 3 -0.076,-0.356 | drill 1.3: 4 -5.08,-4.115; 5 -5.08,-2.591; 6 -0.838,-0.356; 7 0.686,-0.356; 8 -0.838,-6.35; 9 0.686,-6.35
W237-102 = drill 1.194 long: 1 -2.5,-1.27; 2 2.5,-1.27

### Placement (x,y rotation side)
3V3  68.82,17.53 180 top
B0  66.79,40.64 90 top
B1  27.8,37.59 270 top
C1  67.53,4.56 90 top
C2  67.56,12.39 270 top
C3  72.88,2.98 0 top
C4  56.33,11.86 270 top
C5  17.23,29.42 0 top
C6  70.22,31.75 0 top
C7  58.66,42.8 0 top
C10  43.77,47.75 180 top
C11  39.07,51.69 180 top
C12  59.64,51.56 180 top
C13  54.89,51.56 0 top
C42  49.48,47.75 180 top
C43  33.52,29.21 90 top
C44  45.84,19.68 180 top
C45  71.78,59.05 0 top
C46  70.26,28.57 0 top
C47  78.73,10.71 90 top
C48  71.78,54.23 0 top
C49  30.38,58.55 0 top
C50  54.94,47.88 180 top
C51  39.07,47.88 180 top
C52  58.7,39.37 0 top
C53  40.76,19.68 0 top
C54  50.66,19.68 180 top
C55  24.25,37.47 270 top
C56  30.38,54.99 0 top
C65  27.68,42.93 270 top
C66  24.25,47.88 270 top
C68  24.25,42.93 270 top
C69  27.68,47.88 270 top
COM  60.19,65.53 0 top
CTS  57.9,28.96 270 top
D3  4.24,19.45 90 top
D4  24.39,28.5 180 top
F1  81.27,27.69 90 top
H1  81.02,4.45 90 top
H2  4.31,4.57 90 top
H3  -6.36,77.47 90 top  (outside the outline)
H4  80,66.04 90 top
I/O  28.95,65.53 180 top
IC1  63.24,32.51 90 top
JP1  61.46,23.88 180 top
JTAG  82.54,17.27 90 top
L1  75.94,27.69 90 top
L2  15.58,12.9 0 top
L3  30.85,42.93 90 top
LM2576-12V1  29.98,20.16 180 top
PC4  51.11,13.23 90 top
PC5  60.83,4.34 90 top
PC6  17.36,36.86 180 top
Q1  44.19,56.9 0 top
Q2  59.93,56.9 0 top
R1  28.17,28.63 0 top
R2  20.87,32.55 270 top
R3  27.08,32.04 270 top
R4  30.98,36.83 90 top
R5  63.11,39.71 270 top
R7  70.22,38.48 180 top
R8  70.22,35.05 180 top
R9  70.22,41.91 180 top
R13  43.84,51.69 0 top
R14  49.48,51.69 180 top
R15  59.77,47.88 180 top
R21  31.23,47.88 270 top
RESET  67.76,46.86 0 top
RTS  57.9,34.04 270 top
SERIAL  9.13,46.48 90 top
SJ1  74.16,21.08 180 top
T1  24.17,32.68 0 top
U1  73.61,10.04 180 top
U2  61.15,12.78 180 top
U$2  45.35,33.42 270 top
X1  7.61,66.29 180 top
X2  80.51,39.12 90 top
X5  40.3,3.94 180 top
X6  52.26,4.84 0 top

### Tracks (layer width: path | path; a pad name or v marks a point on that pad's centre or on a via)
3.3V  (via drill 0.35)
  Top 0.152: L3.1 30.8,42.24 30.8,41.86 30.11,41.17 30.11,40.49 v29.96,40.13 | 42.5,40.07 42.61,39.95 46.12,39.95 46.34,40.18 U$2.11 | 42.5,40.07 42.46,40.11 42.46,40.95 U$2.19 | 42.5,40.07 40.86,38.43 37.81,38.43 U$2.28
  Top 0.305: IC1.6 64.25,30.2 v64.25,28.96 | U$2.100 53.64,39.42 v54.35,39.88 | U$2.75 51.35,25.09 v52.06,24.38 | U$2.50 36.81,27.42 v36.06,26.67 | U$2.19 42.35,42.36 v43.17,43.18
  Top 0.508: C51.1 39.92,46.18 v39.87,45.47
  Top 0.813: C1.+ 71.07,2.02 C3.1 72.03,5.36 U1.4 | C46.1 v68.19,28.57 | U1.2 73.61,15.2 v73.65,15.24 | B0.1 v66.79,37.34 | C52.1 v56.63,39.37 | C7.1 v56.63,42.8 | C50.1 55.79,46.15 v55.74,46.1 | C54.1 v53.08,19.68 | C53.1 39.91,22.06 v39.87,22.1 | B1.1 28.82,40.13 v29.96,40.13 | C55.1 v24.25,39.75 | C56.1 v27.93,54.99 | C49.1 v27.93,58.55 | C48.1 v69.2,54.23 | C45.1 v69.08,59.05
  Top 1.27: U1.2 U1.4 75.81,6.94 C47.1 82.24,9.86 83.54,11.16 JTAG.1
  3.3V 0.508: v39.87,45.47 39.74,45.34
  3.3V 0.813: v56.63,42.8 56.63,42.93 | v55.74,46.1 55.87,46.23 | v53.08,19.68 53.08,19.56 | v27.93,54.99 27.93,55.12 | v27.93,58.55 27.93,58.67 | v69.2,54.23 69.33,54.1 | v69.08,59.05 69.08,59.18
  pour 3.3V: 84.95,0.38 0.37,0.38 0.37,70.48 84.95,70.48
+5V  (via drill 0.35)
  Top 0.152: IC1.7 64.79,30.28 65.47,30.96 IC1.8 65.55,31.04 65.78,31.04
  Top 0.254: 65.78,31.04 66.77,31.04
  Top 0.508: 66.77,31.04 C6.1
  Top 1.016: C6.1 v69.33,33.02
  Top 1.27: C6.1 69.33,31.24 70.35,30.23 72.13,30.23 73.14,29.21 73.14,23.88 74.16,22.86 SJ1.2 | I/O.19 12.44,61.72 12.44,54.86 SERIAL.15 SERIAL.16
  3.3V 0.813: COM.15 COM.16
  3.3V 1.27: v69.33,33.02 69.33,50.55 66.54,53.34 COM.15 66.54,68.1 65.66,68.97 19.69,68.97 I/O.19
+12V  (via drill 0.35)
  Top 0.813: 58.66,16.51 58.83,16.34 | 58.83,16.34 U2.3 | 58.83,16.34 58.83,18.5 v58.79,18.54
  Top 1.016: PC4.+ 51.36,15.88 U2.3 58.83,18.5
  Top 1.27: 3V3.3 v65.78,17.53
  3.3V 1.016: 17.52,63.75 I/O.20
  3.3V 1.27: v58.79,18.54 64.76,18.54 v65.78,17.53 | LM2576-12V1.P$4 23.95,20.16
  3.3V 2: 5.96,31.24 3.29,33.91 3.29,57.91 | 3.29,57.91 3.29,58.93 4.54,60.24 8.12,64.01 8.12,64.26 I/O.20 | X1.3 2.53,61.72 3.29,57.91
  3.3V 3: LM2576-12V1.P$4 15.35,20.16 14.69,19.5 | X1.3 2.61,34.59 5.96,31.24 12.87,31.24 C5.+
  3.3V 4.2: L2.P$2 14.69,19.5 C5.+
  Bottom 1.27: LM2576-12V1.P$4 28.73,20.16 31.04,17.85 58.1,17.85 v58.79,18.54
BOOT0
  Top 0.152: R5.2 63.11,38.81 60.44,38.81 58.61,36.98 55.11,36.98 54.57,36.45 52.97,36.45 U$2.94
BOOT1
  Top 0.152: R4.2 31.03,37.67 33.39,37.67 35.75,35.31 35.75,34.54 36.36,33.93 37.73,33.93 U$2.37
CAN1_TX  (via drill 0.35)
  Top 0.152: v49.32,27.23 49.32,25.86 U$2.71 | COM.6 53.81,66.78 53.81,64.26 COM.5
  Bottom 0.152: v49.32,27.23 49.32,40.18 47.72,41.78 47.72,58.17 53.81,64.26 COM.5
ETH_MISO  (via drill 0.35)
  Top 0.152: v47.06,61.39 49.95,61.39 51.3,62.74 COM.3 | U$2.31 38.99,36.92 39.77,36.14 v41.21,36.14
  Bottom 0.152: 42.1,55.68 v47.06,61.39
  Bottom 0.2: v41.21,36.14 41.21,37.18 39.92,38.48 39.92,39.3 40.99,40.37 40.99,52.48 40.25,53.21 40.25,53.83 42.1,55.68
ETH_MOSI  (via drill 0.35)
  Top 0.152: v37.2,40.56 35.75,39.12 35.75,37.59 36.9,36.45 37.73,36.45 U$2.32
  Bottom 0.152: v37.2,40.56 37.2,54.59 48.4,65.79 50.31,65.79 51.3,66.78 COM.4
ETH_SCK  (via drill 0.35)
  Top 0.2: U$2.30 39.91,37.42 v40.15,37.19
  Bottom 0.152: v40.15,37.19 39.26,37.59 36.06,40.79 36.06,55.37 47.49,66.8 COM.2
ETH_SS  (via drill 0.35)
  Top 0.152: v41.32,37.97 37.81,37.97 U$2.29
  Bottom 0.152: v41.32,37.97 41.32,44.76 46.66,50.1 46.66,58.18 49.01,60.53 49.01,64.01 COM.1
GND  (via drill 0.35)
  Top 0.152: 63.18,32.26 63.18,30.96 62.8,30.58 62.8,30.28 IC1.3 | 63.18,32.26 63.18,32.49 IC1.EXP v60.44,35.31 | X2.4 77.82,40.34 77.88,40.45 | R2.1 20.87,34.95 v20.82,35 | B0.3 v66.79,43.69 | U$2.10 46.73,41.14 46.73,41.92 46.69,41.95 v46.69,42.93 | C42.1 52.11,45.97 v52.82,45.97 | C43.2 31.4,30.06 v29.71,31.75 | B1.3 27.17,36.07 v25.9,37.34 | C55.2 23.14,36.62 v23.1,36.58 | C7.2 59.55,44.32 v59.68,44.45 | C52.2 59.81,39.62 v61.71,39.62 | IC1.M 62.98,32.26 63.18,32.26 | C13.2 57.01,52.83 v57.24,52.83 | C10.2 42.92,46.48 v43.42,45.97 | 41.38,39.38 41.85,39.85 U$2.20 41.73,40.9 41.73,40.13 41.59,39.99 | 41.59,39.99 40.52,38.92 U$2.27 | v40.55,39.04 40.55,39.72 40.82,39.99 41.59,39.99 | C46.2 v71.11,26.42 | C6.2 71.36,32 v72.63,32 | C3.2 74.81,4.06 v75.94,4.06
  Top 0.508: R8.1 v72.63,36.07
  GND 0.152: v20.82,35 20.82,34.8 | v46.69,42.93 46.73,42.93 | v57.24,52.83 57.39,52.83 | v40.55,39.04 40.2,39.04 40.12,39.12
  pour GND: 84.95,0.38 0.37,0.38 0.37,70.48 84.95,70.48
  pour Top: 85.08,0.25 0.24,0.25 0.24,70.61 85.08,70.61
N$1
  Top 1.016: D3.C 5.2,12.9 L2.P$1 18.48,12.9 23.36,17.78 30.47,17.78 31.68,18.99 LM2576-12V1.P$2
N$2
  Top 0.813: D4.A 22.09,29.23 22.09,30.73 21.24,31.58 | R2.2 21.12,31.7 21.24,31.58 | T1.1 21.24,31.58
N$3
  Top 0.813: R1.1 26.1,28.63 D4.C
N$4
  Top 0.813: R3.2 25.51,31.19 25.43,31.28 | 25.43,31.28 T1.2 | LM2576-12V1.P$5 24.37,25.76 24.37,30.23 25.43,31.28
N$5
  Top 0.152: B1.2 28.06,37.59 29.66,35.99 30.95,35.99 R4.1
N$6
  Top 0.152: R5.1 66.69,40.56 66.77,40.64 B0.2
N$8
  Top 0.152: IC1.9 65.55,31.57 66.31,31.57 66.77,32.03 67.53,32.03 67.55,32 68.29,32.74 68.29,33.27 69.37,34.35 R8.2
  Top 0.61: R8.2 R7.2
N$9
  Top 0.152: R13.1 43.07,51.84 43.53,52.3 43.53,52.38 48.02,56.87 49.01,56.87 Q1.2
  Top 0.406: C11.1 R13.1
N$10
  Top 0.254: R15.1 60.62,51.44 C12.1 64.76,55.83 Q2.2
N$11
  Top 0.152: JP1.3 62.27,24.33 62.27,30.2 IC1.2
N$12
  Top 0.254: Q2.1 54.04,55.83 C13.1 53.92,51.69 R14.1
N$13  (via drill 0.35)
  Top 0.152: v63.34,28.68 63.34,28.9 63.72,29.29 63.72,30.2 IC1.5
  Bottom 0.152: v63.34,28.68 63.34,31.34 69.81,37.82 75.76,37.82 X2.2
N$14  (via drill 0.35)
  Top 0.152: IC1.4 63.18,30.2 63.18,29.44 62.73,28.98 62.73,28.37 v63.62,26.92
  GND 0.152: v63.62,26.92 68.41,26.92 73.95,32.46 73.95,34.02 X2.3
N$16
  Top 0.152: C44.1 46.73,19.68 46.73,21.36 50.31,24.94 50.31,25.78 U$2.73
N$17
  Top 0.305: R7.1 73.91,38.48 X2.1 78.1,42.67 79.75,42.67 81.02,41.4 81.02,37.59 75.94,32.51 L1.2
N$18
  Top 0.813: L1.1 77.03,25.74 81.03,29.73 F1.2
N$19
  Top 0.152: IC1.1 61.66,30.2 61.66,25.32 60.21,23.88 JP1.4
N$20
  Top 0.152: C43.1 33.54,28.3 36.59,28.3 36.9,27.99 37.73,27.99 U$2.49
N$21  (via drill 0.35)
  Top 0.152: 67.49,33.21 68.59,34.32 68.59,41.1 69.36,41.86 R9.2 | 67.49,33.21 66.69,32.41 66.08,32.41 66.01,32.49 65.55,32.49 IC1.11 | 67.49,33.21 v67.07,33.63
  Bottom 0.152: v67.07,33.63 66.08,33.63 65.32,32.87 65.32,23.88 JP1.2
N$26  (via drill 0.35)
  Top 0.152: v66.39,33.02 65.55,33.02 IC1.12
  Bottom 0.152: v66.39,33.02 66.39,25.25 67.76,23.88 JP1.1
N$27
  Top 0.152: IC1.28 60.9,30.96 60.21,30.28 60.21,26.39 57.7,23.88 JP1.5
N$41
  Top 0.152: IC1.24 60.9,32.94 59.83,32.94 57.93,31.04 57.93,29.74 CTS.1
N$44
  Top 0.152: IC1.23 60.9,33.55 59.38,33.55 58.16,34.77 57.93,34.77 RTS.1
N$45
  Top 0.813: C2.1 68.82,14.51 68.82,14.99 | 68.82,14.99 3V3.2 | U1.3 70.67,13.14 68.82,14.99
NRF_CE  (via drill 0.35)
  Top 0.152: v51.6,35.99 52.14,35.46 52.9,35.46 U$2.92
  Bottom 0.152: v51.6,35.99 51.6,37.52 52.06,37.97 52.06,39.34 50.23,41.17 50.23,56.64 57.93,64.34 57.93,65.79 58.92,66.78 COM.10
NRF_CS  (via drill 0.35)
  Top 0.152: v55.18,36.14 54.04,36.14 53.89,35.99 52.97,35.99 U$2.93
  Bottom 0.152: COM.11 61.43,64.26 61.43,43.94 57.42,39.93 57.42,38.84 56.4,37.82 56.4,37.36 v55.18,36.14
NRF_IRQ  (via drill 0.35)
  Top 0.152: v57.09,37.59 55.26,37.59 54.65,36.98 52.97,36.98 U$2.95
  Bottom 0.152: COM.12 61.51,66.78 62.5,65.79 62.5,43.46 58.92,39.88 58.92,38.61 57.9,37.59 v57.09,37.59
NRF_MISO
  Top 0.152: COM.9 59.91,63.27 62.8,63.27 68.24,58.09 68.24,37.24 67.3,36.3 57.19,36.3 55.36,34.47 52.97,34.47 U$2.90
NRF_MOSI  (via drill 0.35)
  Top 0.152: v54.35,35.54 53.74,34.93 52.97,34.93 U$2.91 | v57.85,60.38 57.85,65.33 COM.8
  Bottom 0.152: v54.35,35.54 54.35,37.08 55.87,38.61 55.87,40.64 57.85,42.62 v57.85,60.38
NRF_SCK  (via drill 0.35)
  Top 0.152: v50.99,36.68 50.99,35.08 52.14,33.93 52.9,33.93 U$2.89
  Bottom 0.152: COM.7 55.72,64.26 48.33,56.87 48.33,42.09 48.63,41.78 48.71,41.78 51.75,38.73 51.75,38.12 50.99,37.36 v50.99,36.68 50.99,35.15 58.99,27.15 59.15,27.15 61.2,25.09 61.2,23.19 67.07,17.32 81.47,17.32 JTAG.6
PC14
  Top 0.152: R15.2 58.46,47.88 54.19,43.61 49.24,43.61 47.87,42.24 47.87,41.1 U$2.8
PC15
  Top 0.254: R14.2 47.35,50.41 U$2.9
PE0  (via drill 0.35)
  Top 0.152: v54.35,37.97 52.97,37.97 U$2.97
  3.3V 0.152: v54.35,37.97 55.62,39.37 55.62,40.89 46.73,49.78 46.73,51.82 45.2,53.34 45.2,66.04 44.44,66.8 I/O.1
  Bottom 0.152: 53.89,37.97 v54.35,37.97 | 40.4,66.85 I/O.1
PE1  (via drill 0.35)
  Top 0.152: v51.15,38.43 52.9,38.43 U$2.98
  GND 0.152: v51.15,38.43 47.49,42.16 47.49,51.82 I/O.2
PE2
  Top 0.152: I/O.3 39.61,68.58 43.17,68.58 45.29,66.46 45.29,61.45 46.98,59.77 65.85,59.77 67.68,57.94 67.68,47.65 61.9,41.87 52.2,41.87 U$2.1
PE3  (via drill 0.35)
  Top 0.152: v50.84,43 50.84,41.1 U$2.2
  GND 0.152: v37.89,64.26 I/O.4
  3.3V 0.152: v50.84,43 50.84,44.15 41.54,53.44 41.54,57.56 v37.89,64.26
PE4  (via drill 0.35)
  Top 0.152: v49.62,43 50.31,42.32 50.31,41.1 U$2.3 | v51.53,59.16 45.38,59.16 42.56,65.79 36.29,65.79 35.3,66.78 I/O.5
  Bottom 0.152: v49.62,43 49.62,57.25 v51.53,59.16
PE5  (via drill 0.35)
  Top 0.152: U$2.4 49.85,39.45 47.2,36.79 43.51,36.79 v41.16,34.44
  Bottom 0.152: v41.16,34.44 40.05,34.44 39.26,35.43 38.95,35.69 36.97,37.67 36.97,38.86 36.97,38.87 36.97,39.06 36.03,40 35.5,40 35.3,40.2 I/O.6
PE6  (via drill 0.35)
  Top 0.152: v48.94,42.39 49.32,42.01 49.32,41.1 U$2.5 | v48.94,53.14 49.24,53.14 51.91,55.8 51.91,58.01 51.37,58.55 45.02,58.55 41.65,65.35 34.33,65.35 I/O.7
  Bottom 0.152: v48.94,53.14 v48.94,42.39
PE7  (via drill 0.35)
  Top 0.152: v33.09,37.06 33.09,36.75 36.36,33.48 37.73,33.48 U$2.38
  Bottom 0.152: I/O.8 32.78,64.26 32.74,64.01 33.09,63.66 v33.09,37.06
PE8  (via drill 0.35)
  Top 0.152: v39.11,32.94 37.81,32.94 U$2.39
  3.3V 0.152: v39.11,32.94 39.11,34.7 29.53,44.27 29.53,59.77 31.5,61.74 31.5,65.28 30.22,66.57 I/O.9
PE9  (via drill 0.35)
  Top 0.152: v32.17,37.06 32.78,36.45 32.86,36.45 36.82,32.49 37.73,32.49 U$2.40
  Bottom 0.152: I/O.10 30.27,64.26 30.23,64.05 32.17,62.11 v32.17,37.06
PE10  (via drill 0.35)
  Top 0.152: v39.11,32.03 39.03,31.95 37.81,31.95 U$2.41
  GND 0.152: v39.11,32.03 37.81,33.33 37.81,52.15 34.38,56.72 34.38,58 28.93,63.45 28.93,65.53 27.68,66.78 I/O.11
PE11  (via drill 0.35)
  Top 0.152: v34.15,34.24 36.9,31.5 37.73,31.5 U$2.42
  GND 0.152: v34.15,34.24 34.15,54.61 32.82,55.94 32.82,58.35 30.82,60.36 28.53,60.36 27.68,61.21 I/O.12
PE12  (via drill 0.35)
  Top 0.152: v36.21,30.96 37.73,30.96 U$2.43
  GND 0.152: v36.21,30.96 35.32,30.96 23.87,42.42 23.87,65.53 I/O.13
PE13  (via drill 0.35)
  Top 0.152: v39.11,30.96 38.57,30.43 37.81,30.43 U$2.44 | v42.2,44.27 42.08,48.34 39.49,50.93 36.74,50.93 29.89,57.79 27.75,57.79 25.16,63.42 25.16,64.26 I/O.14
  Bottom 0.152: v39.11,30.96 39.11,31.11 41.92,33.93 41.92,42.77 42.03,43.18 42.03,43.33 v42.2,44.27
PH0
  Top 0.254: U$2.12 45.85,50.53 R13.2
PH1  (via drill 0.35)
  Top 0.254: U$2.13 45.35,47.02 C10.1 44.62,48.94 v44.69,49.02
  Top 0.406: v40.88,53.47 39.36,54.99 Q1.1
  Bottom 0.254: v44.69,49.02 44.69,49.66 v40.88,53.47
REG_5V
  Top 0.61: 62.73,9.68 U2.4
  Top 0.813: 60.95,6.86 PC5.+ 60.83,9.36 U2.4 57.62,9.68 C4.2 | 61.15,15.49 60.95,15.69 U2.2 61.15,17.27
  Top 1.016: 61.15,17.27 64.96,21.08 SJ1.3 71.62,18.8 3V3.1 | U2.4 61.15,15.49 | C4.2 57.94,9.36 60.83,9.36
RESET
  Top 0.152: 48.94,47.8 48.63,47.8 C42.2 48.63,48.11 49.54,49.02 | RESET.1 64.56,46.89 60.21,46.89 59.83,47.27 59.83,48.41 59.22,49.02 49.54,49.02 | 49.54,48.95 49.54,49.02 | 49.54,49.02 49.54,52.22 49.24,52.53 44.13,52.53 43.83,52.22 43.83,47.12 44.82,46.13 44.82,41.1 U$2.14
RX1
  Top 0.152: U$2.36 37.81,34.39 38.57,34.39 39.72,33.25 39.72,28.07 37.66,26.01 35.3,26.01 33.77,27.53 32.17,27.53 27.6,32.11 26.15,32.11 25.7,32.56 24.55,32.56 24.02,32.03 24.02,30.81 23.56,30.35 23.56,27.99 23.33,27.76 18.07,27.76 11.83,34.01 8.86,34.01 7.86,35 SERIAL.2
RX2  (via drill 0.35)
  Top 0.152: v36.36,38.81 36.97,39.42 37.73,39.42 U$2.26
  Bottom 0.152: v36.36,38.81 35.75,38.81 32.63,35.69 20.44,35.69 20.36,35.61 11.75,35.61 10.76,36.6 8.86,36.6 SERIAL.4
RX3  (via drill 0.35)
  Top 0.152: v15.94,39.12 19.37,39.12 22.72,35.76 24.32,35.76 25.16,34.93 30.42,34.93 36.9,28.45 37.73,28.45 U$2.48
  Bottom 0.152: v15.94,39.12 8.86,39.12 7.86,40.11 SERIAL.6
RX4  (via drill 0.35)
  Top 0.152: v31.18,41.33 31.94,42.09 39.56,42.09 39.79,41.86 39.79,41.1 U$2.24
  Bottom 0.152: v31.18,41.33 9.16,41.33 7.86,42.62 SERIAL.8
RX5  (via drill 0.35)
  Top 0.152: v38.65,24.79 47.64,24.79 47.79,24.94 47.79,25.78 U$2.68 | v7.99,27.91 6.87,34.62 6.87,44.22 SERIAL.10
  Bottom 0.152: v38.65,24.79 34.38,24.79 31.26,27.91 v7.99,27.91
RX6  (via drill 0.35)
  Top 0.152: v48.71,36.14 49.93,37.36 52.9,37.36 U$2.96
  Bottom 0.152: SERIAL.12 7.86,47.73 6.87,46.74 6.87,37.14 7.41,36.6 7.79,36.6 8.86,35.54 8.86,34.7 9.92,33.63 34.46,33.63 38.37,29.72 39.11,29.72 45.53,36.14 v48.71,36.14
TCK/SWCLK  (via drill 0.35)
  Top 0.152: v59.3,27.76 58.84,27.3 54.12,27.3 54.04,27.38 52.97,27.38 U$2.76
  Bottom 0.152: v59.3,27.76 61.05,27.76 64.25,24.56 64.25,22.66 68.67,18.24 82.62,18.24 83.53,17.32 JTAG.5
TDI  (via drill 0.35)
  Top 0.152: v54.42,27.91 52.97,27.91 U$2.77
  Bottom 0.152: v54.42,27.91 55.79,27.91 59.15,24.56 59.15,22.73 65.62,16.26 82.62,16.26 83.53,15.34 JTAG.3
TMS/SWDIO
  Top 0.152: U$2.72 49.93,25.86 49.93,26.7 50.15,26.92 51.53,26.92 54.12,24.33 54.12,22.66 54.65,22.12 70.42,22.12 70.88,22.58 72.41,22.58 73.24,21.74 73.24,19.76 77.66,15.34 81.47,15.34 JTAG.4
TX1  (via drill 0.35)
  Top 0.152: v36.36,34.85 37.73,34.85 U$2.35
  Bottom 0.152: v36.36,34.85 24.78,34.85 24.32,34.39 11.06,34.39 SERIAL.1
TX2  (via drill 0.35)
  Top 0.152: v29.96,39.19 31.94,41.17 37.51,41.17 37.58,41.1 39.33,41.1 U$2.25
  Bottom 0.152: v29.96,39.19 24.55,39.19 23.41,38.05 10.91,38.05 10.46,37.59 SERIAL.3
TX3
  Top 0.152: U$2.47 37.73,28.98 36.82,28.98 30.57,35.23 26.91,35.23 25.01,37.14 25.01,37.29 24.78,37.52 21.43,37.52 18.84,40.11 10.46,40.11 SERIAL.5
TX4
  Top 0.152: U$2.23 40.32,41.1 40.32,41.86 39.26,42.93 10.68,42.93 10.46,42.7 SERIAL.7
TX5  (via drill 0.35)
  Top 0.152: v46.73,27.23 47.34,26.62 47.34,25.86 U$2.67 | v21.12,30.2 20.67,30.2 15.26,35.61 13.81,35.61 10.3,39.12 10,39.12 9.39,39.73 9.39,44.22 10.38,45.21 SERIAL.9
  Bottom 0.152: v46.73,27.23 36.36,27.23 33.39,30.2 v21.12,30.2
TX6  (via drill 0.35)
  Top 0.152: v47.79,27.23 48.33,26.7 48.33,25.86 U$2.69 | v18.23,29.13 10.76,36.6 9.92,36.6 9.08,37.44 9.08,46.43 SERIAL.11
  Bottom 0.152: v47.79,27.23 47.64,27.23 46.42,26.01 33.7,26.01 30.5,29.21 21.28,29.21 20.29,28.22 19.14,28.22 v18.23,29.13
USART2_CTS
  Top 0.152: U$2.84 52.97,31.42 54.42,31.42 57.62,28.22 57.85,28.22 CTS.2
USART2_RTS
  Top 0.152: U$2.85 52.97,31.95 56.56,31.95 57.85,33.25 RTS.2
USART2_RX  (via drill 0.35)
  Top 0.152: v60.06,31.8 60.21,31.95 60.9,31.95 IC1.26 | v55.64,32.87 52.97,32.87 U$2.87
  Bottom 0.152: v60.06,31.8 56.71,31.8 v55.64,32.87
USART2_TX
  Top 0.152: IC1.25 60.9,32.49 59.83,32.49 59.45,32.11 59.45,28.52 59.91,28.07 59.91,27.46 59.45,27 52.06,27 51.91,27.15 51.91,32.18 52.14,32.41 52.9,32.41 U$2.86
USB_OTG_HS_DM  (via drill 0.35)
  Top 0.152: v52.21,40.56 51.6,39.95 51.15,39.95 40.4,29.21 40.4,25.86 U$2.53
  GND 0.152: v52.21,40.56 57.14,45.21 57.14,50.55 64,58.17 COM.13
USB_OTG_HS_DP  (via drill 0.35)
  Top 0.152: v60.44,40.49 53.81,40.49 53.28,39.95 52.14,39.95 51.83,39.65 51.3,39.65 40.86,29.21 40.86,25.86 U$2.54
  Bottom 0.152: COM.14 65.01,65.79 65.01,43.94 61.56,40.49 v60.44,40.49
VDDA
  Top 0.254: R21.2 36.53,47.03 40.88,42.67 40.85,42.64 U$2.22
  Top 0.508: C68.1 C65.1 30.65,43.78 L3.2 31.23,43.96 R21.2
VIN  (via drill 0.35)
  Top 0.813: R1.2 30.16,28.63 v30.22,28.57 | T1.3 24.17,35 v24.12,35.05
  3.3V 0.813: v30.22,28.57 30.22,28.45
  3.3V 1.016: X5.2 40.37,13.71 40.38,13.72
  3.3V 2: 19.91,61.37 I/O.18
  3.3V 3: PC6.+ 19.91,61.37
  Bottom 2: I/O.18 19.43,63.64 19.43,63.47 18.19,62.23 14.21,62.23 12.61,63.83 X1.1
  pour 3.3V: 51.55,1.52 51.55,8.89 21.83,38.61 19.29,38.61 18.28,37.59 18.28,36.07 19.55,34.8 21.58,34.8 31.99,24.38 31.99,22.61 37.84,16.76 37.84,9.14 39.36,7.62 41.9,7.62 44.69,10.41 45.96,10.41 47.74,8.64 47.74,2.03 48.76,1.02 51.04,1.02
VREF+
  Top 0.254: R21.1 32.29,49.78 40.12,49.78 41.39,48.51 41.39,41.91 41.35,41.87 U$2.21
  Top 0.508: R21.1 C69.1 C66.1
VUSB2
  Top 0.813: SJ1.1 F1.1